# EAGLE design shield3 (EAGLE 7.6.0)
Cypress Robot Kit
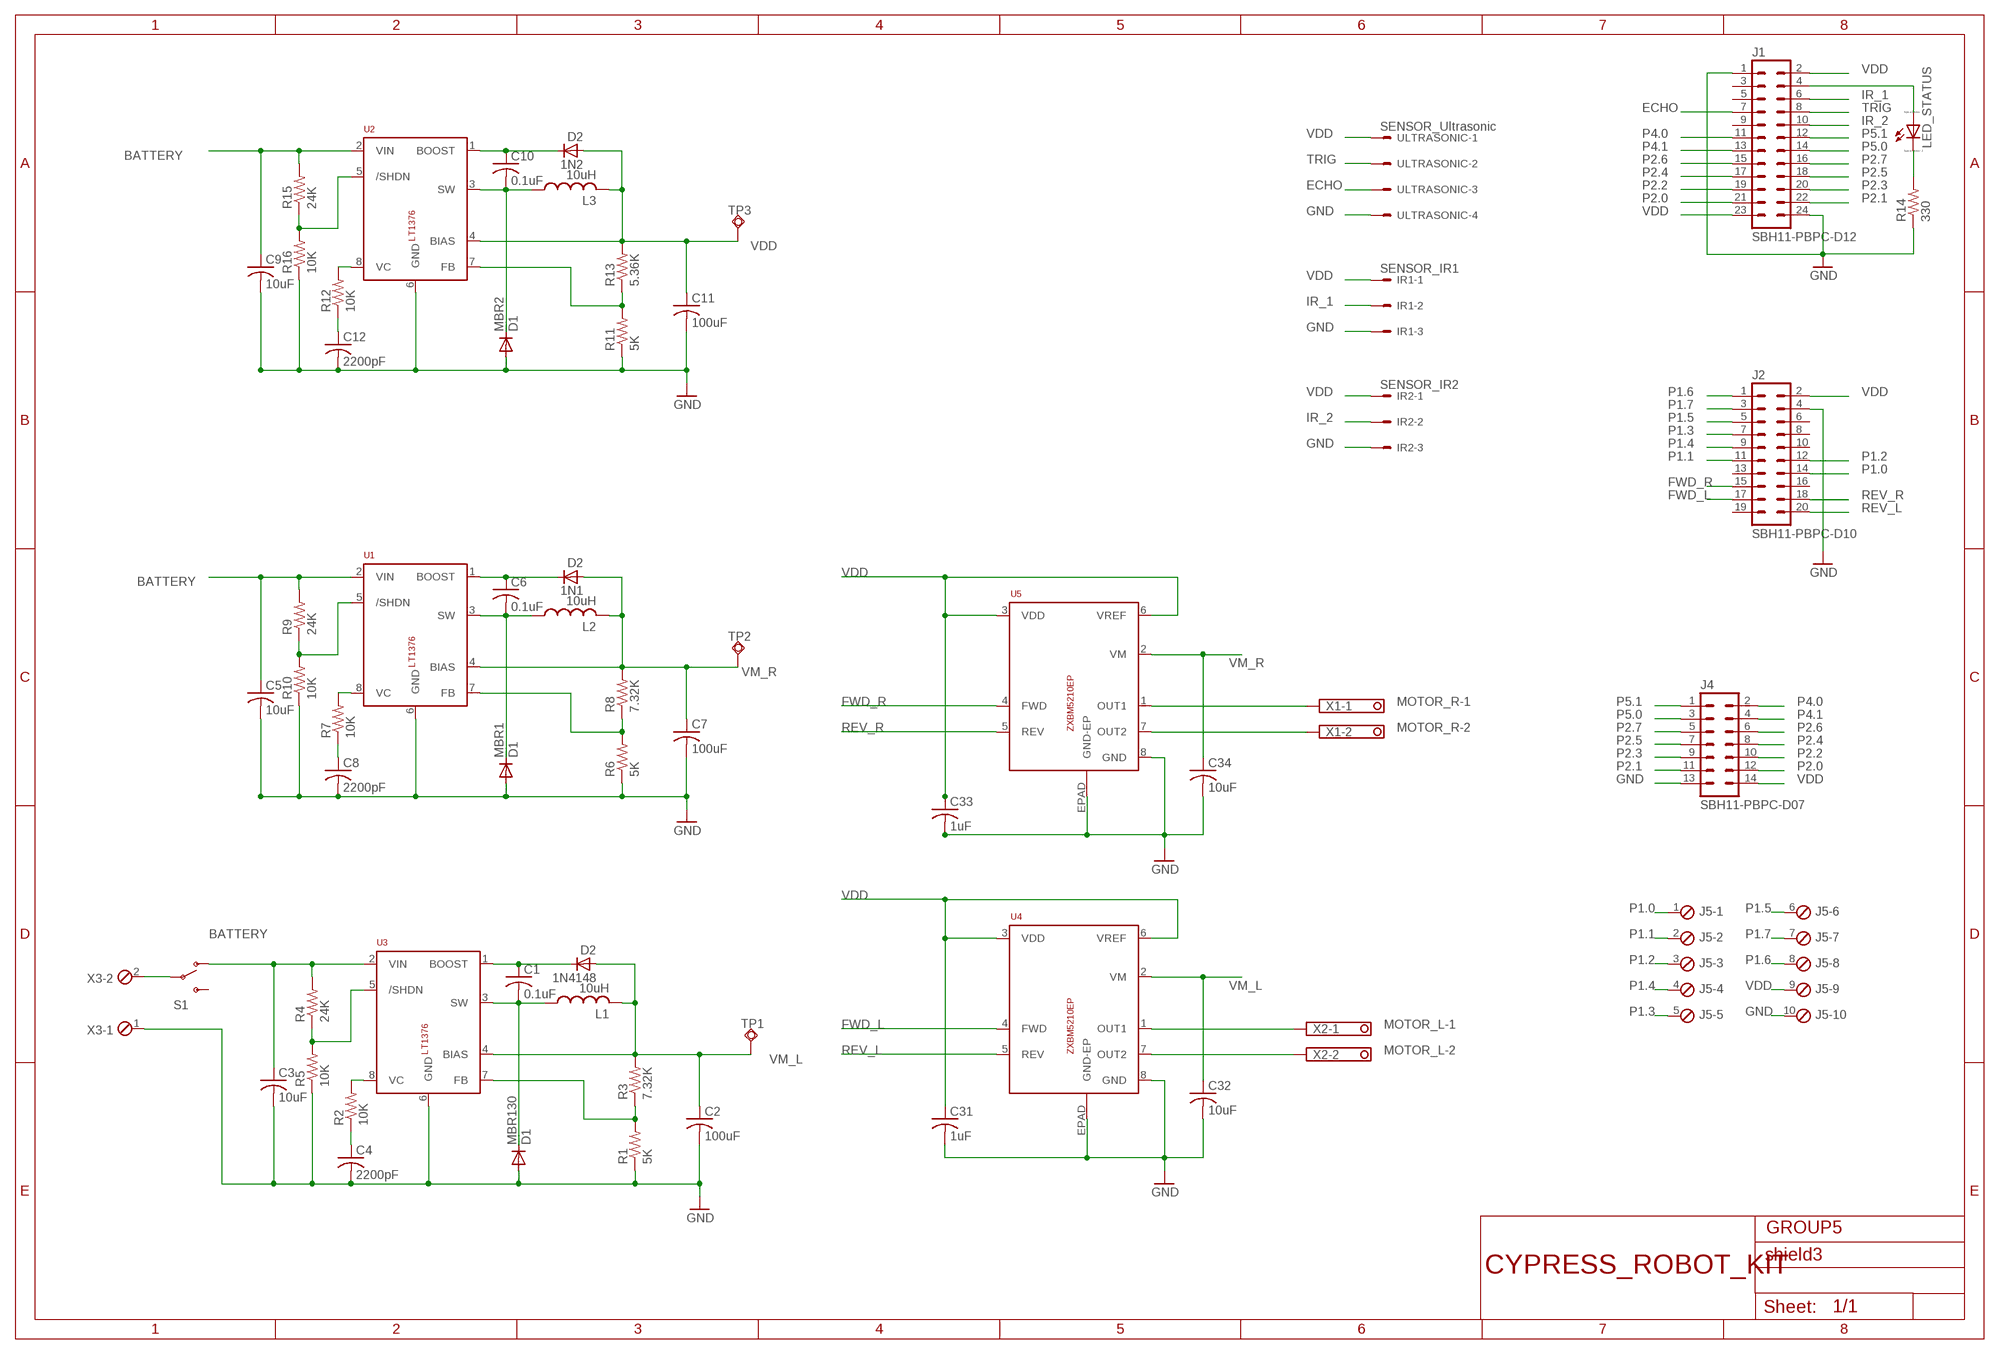
[diagram p0: schematic, sheet 1]

## Parts
1N1  D2  D-SOD123  [SOD123]
1N2  D2  D-SOD123  [SOD123]
1N4148  D2  D-SOD123  [SOD123]
C1  0.1uF  C-USC1206  [C1206]
C2  100uF  C-USC1206  [C1206]
C3  10uF  C-USC1206  [C1206]
C4  2200pF  C-USC1206  [C1206]
C5  10uF  C-USC1206  [C1206]
C6  0.1uF  C-USC1206  [C1206]
C7  100uF  C-USC1206  [C1206]
C8  2200pF  C-USC1206  [C1206]
C9  10uF  C-USC1206  [C1206]
C10  0.1uF  C-USC1206  [C1206]
C11  100uF  C-USC1206  [C1206]
C12  2200pF  C-USC1206  [C1206]
C31  1uF  C-USC3216  [C3216]
C32  10uF  C-USC3216  [C3216]
C33  1uF  C-USC3216  [C3216]
C34  10uF  C-USC3216  [C3216]
IR1  SENSOR_IR1  22-27-2031-03  [6410-03]
IR2  SENSOR_IR2  22-27-2031-03  [6410-03]
J1  SBH11-PBPC-D12  [SBH11-PBPC-D12]
J2  SBH11-PBPC-D10  [SBH11-PBPC-D10]
J4  SBH11-PBPC-D07  [SBH11-PBPC-D07]
J5  MPT10  [10POL254]
L1  10uH  L-USL4035M  [L4035M]
L2  10uH  L-USL4035M  [L4035M]
L3  10uH  L-USL4035M  [L4035M]
LED_STATUS  LED_E  [LED_1206]
MBR1  D1  DIODE-SOD123  [SOD123]
MBR2  D1  DIODE-SOD123  [SOD123]
MBR130  D1  DIODE-SOD123  [SOD123]
R1  5K  R-US_M3216  [M3216]
R2  10K  R-US_M3216  [M3216]
R3  7.32K  R-US_M3216  [M3216]
R4  24K  R-US_M3216  [M3216]
R5  10K  R-US_M3216  [M3216]
R6  5K  R-US_M3216  [M3216]
R7  10K  R-US_M3216  [M3216]
R8  7.32K  R-US_M3216  [M3216]
R9  24K  R-US_M3216  [M3216]
R10  10K  R-US_M3216  [M3216]
R11  5K  R-US_M3216  [M3216]
R12  10K  R-US_M3216  [M3216]
R13  5.36K  R-US_M3216  [M3216]
R14  330  R-US_M3216  [M3216]
R15  24K  R-US_M3216  [M3216]
R16  10K  R-US_M3216  [M3216]
S1  SWITCH-SPDTPTH  [SWITCH-SPDT]
TP1  TPSQPAD1-13  [P1-13]
TP2  TPSQPAD1-13  [P1-13]
TP3  TPSQPAD1-13  [P1-13]
U1  LT1376  [S8]
U2  LT1376  [S8]
U3  LT1376  [S8]
U4  ZXBM5210EP  [SO08-EPAD]
U5  ZXBM5210EP  [SO08-EPAD]
ULTRASONIC  SENSOR_Ultrasonic  22-27-2041-04  [6410-04]
X1  1751248  [1751248]
X2  1751248  [1751248]
X3  MPT2  [2POL254]

## Nets
BATTERY: C3.1 C5.1 C9.1 R4.2 R9.2 R15.2 S1.1(O) U1.2(VIN) U2.2(VIN) U3.2(VIN)
ECHO: J1.7 ULTRASONIC.3
FWD_L: J2.17 U4.4(FWD)
FWD_R: J2.15 U5.4(FWD)
GND: C2.2 C3.2 C4.2 C5.2 C7.2 C8.2 C9.2 C11.2 C12.2 C31.2 C32.2 C33.2 C34.2 IR1.3 IR2.3 J1.1 J1.24 J2.4 J4.13 J5.10 MBR1.A MBR2.A MBR130.A R1.1 R5.1 R6.1 R10.1 R11.1 R14.1 R16.1 U1.6(GND) U2.6(GND) U3.6(GND) U4.8(GND) U4.EPAD(GND-EP) U5.8(GND) U5.EPAD(GND-EP) ULTRASONIC.4 X3.1
IR_1: IR1.2 J1.6
IR_2: IR2.2 J1.10
MOTOR_L-1: U4.1(OUT1) X2.1
MOTOR_L-2: U4.7(OUT2) X2.2
MOTOR_R-1: U5.1(OUT1) X1.1
MOTOR_R-2: U5.7(OUT2) X1.2
N$1: C1.2 L1.1 MBR130.C U3.3(SW)
N$2: R4.1 R5.2 U3.5(/SHDN)
N$4: R1.2 R3.1 U3.7(FB)
N$6: LED_STATUS.C R14.2
N$7: 1N1.1(C) C6.1 U1.1(BOOST)
N$8: J1.4 LED_STATUS.A
N$9: C6.2 L2.1 MBR1.C U1.3(SW)
N$10: R7.2 U1.8(VC)
N$11: C8.1 R7.1
N$12: R6.2 R8.1 U1.7(FB)
N$13: R9.1 R10.2 U1.5(/SHDN)
N$15: 1N2.1(C) C10.1 U2.1(BOOST)
N$16: 1N4148.1(C) C1.1 U3.1(BOOST)
N$17: C10.2 L3.1 MBR2.C U2.3(SW)
N$18: R2.2 U3.8(VC)
N$19: C4.1 R2.1
N$20: R12.2 U2.8(VC)
N$21: C12.1 R12.1
N$22: R11.2 R13.1 U2.7(FB)
N$23: R15.1 R16.2 U2.5(/SHDN)
N$33: S1.2(P) X3.2
P1.0: J2.14 J5.1
P1.1: J2.11 J5.2
P1.2: J2.12 J5.3
P1.3: J2.7 J5.5
P1.4: J2.9 J5.4
P1.5: J2.5 J5.6
P1.6: J2.1 J5.8
P1.7: J2.3 J5.7
P2.0: J1.21 J4.12
P2.1: J1.22 J4.11
P2.2: J1.19 J4.10
P2.3: J1.20 J4.9
P2.4: J1.17 J4.8
P2.5: J1.18 J4.7
P2.6: J1.15 J4.6
P2.7: J1.16 J4.5
P4.0: J1.11 J4.2
P4.1: J1.13 J4.4
P5.0: J1.14 J4.3
P5.1: J1.12 J4.1
REV_L: J2.20 U4.5(REV)
REV_R: J2.18 U5.5(REV)
TRIG: J1.8 ULTRASONIC.2
VDD: 1N2.2(A) C11.1 C31.1 C33.1 IR1.1 IR2.1 J1.2 J1.23 J2.2 J4.14 J5.9 L3.2 R13.2 TP3.TP U2.4(BIAS) U4.3(VDD) U4.6(VREF) U5.3(VDD) U5.6(VREF) ULTRASONIC.1
VM_L: 1N4148.2(A) C2.1 C32.1 L1.2 R3.2 TP1.TP U3.4(BIAS) U4.2(VM)
VM_R: 1N1.2(A) C7.1 C34.1 L2.2 R8.2 TP2.TP U1.4(BIAS) U5.2(VM)
Unconnected: J1.3 J1.5 J1.9 J2.6 J2.8 J2.10 J2.13 J2.16 J2.19 S1.3(S)

## Library data of the parts
1N1 1N2 1N4148 = semicon-smd-ipc:D-: DIODE unfilled
C1-C12 C31-C34 = rcl:C-US: CAPACITOR, American symbol
IR1 IR2 = con-molex:22-?-03: CONNECTOR wire to board 2.54 mm (.1 inch) pitch header; OC_FARNELL: unknown; OC_NEWARK: unknown
J1 = con-sullins:SBH11-PBPC-D12: HEADER - Vertical, Shrouded
J2 = con-sullins:SBH11-PBPC-D10: HEADER - Vertical, Shrouded
J4 = con-sullins:SBH11-PBPC-D07: HEADER - Vertical, Shrouded
J5 = con-phoenix-254:MPT10: PHOENIX CONNECTOR; OC_FARNELL: unknown; OC_NEWARK: unknown
L1-L3 = rcl:L-US: INDUCTOR, American symbol
LED_STATUS = eagle-ltspice:LED_E: LED Source: http://www.osram.convergy.de Source: www.luxeon.com Source: www.kingbright.com; SPICEMODEL: NONE; SPICEPREFIX: D; SPICETYPE: diode
MBR1 MBR2 MBR130 = diode:DIODE-: DIODE
R1-R13 R15 R16 = rcl:R-US_: RESISTOR, American symbol
R14 = resistor:R-US_: RESISTOR, American symbol
S1 = MyLibrary:SWITCH-SPDT: SPDT Switch Simple slide switch, Spark Fun Electronics SKU : COM-00102 DPDT SMT slide switch, AYZ0202, SWCH-08179; PROD_ID: SWCH-08261
TP1-TP3 = testpad:TPSQ: Test pad
U1-U3 = MyLibrary:LT1376
U4 U5 = MyLibrary:ZXBM5210EP
ULTRASONIC = con-molex:22-?-04: CONNECTOR wire to board 2.54 mm (.1 inch) pitch header; OC_FARNELL: unknown; OC_NEWARK: unknown
X1 X2 = con-phoenix-350:1751248: MKDS 1/ 2-3,5 Printklemme Nennstrom: 10 A Bemessungsspannung: 160 V Raster: 3,5 mm Polzahl: 2 Montageart: Löten Anschlussart: Schraubanschluss Anschlussrichtung vom Leiter zur Platine: 0° Source: http://eshop.phoenixcontact.com .. 1751248.pdf; OC_FARNELL: unknown; OC_NEWARK: unknown
X3 = con-phoenix-254:MPT2: PHOENIX CONNECTOR; OC_FARNELL: unknown; OC_NEWARK: unknown

## Board
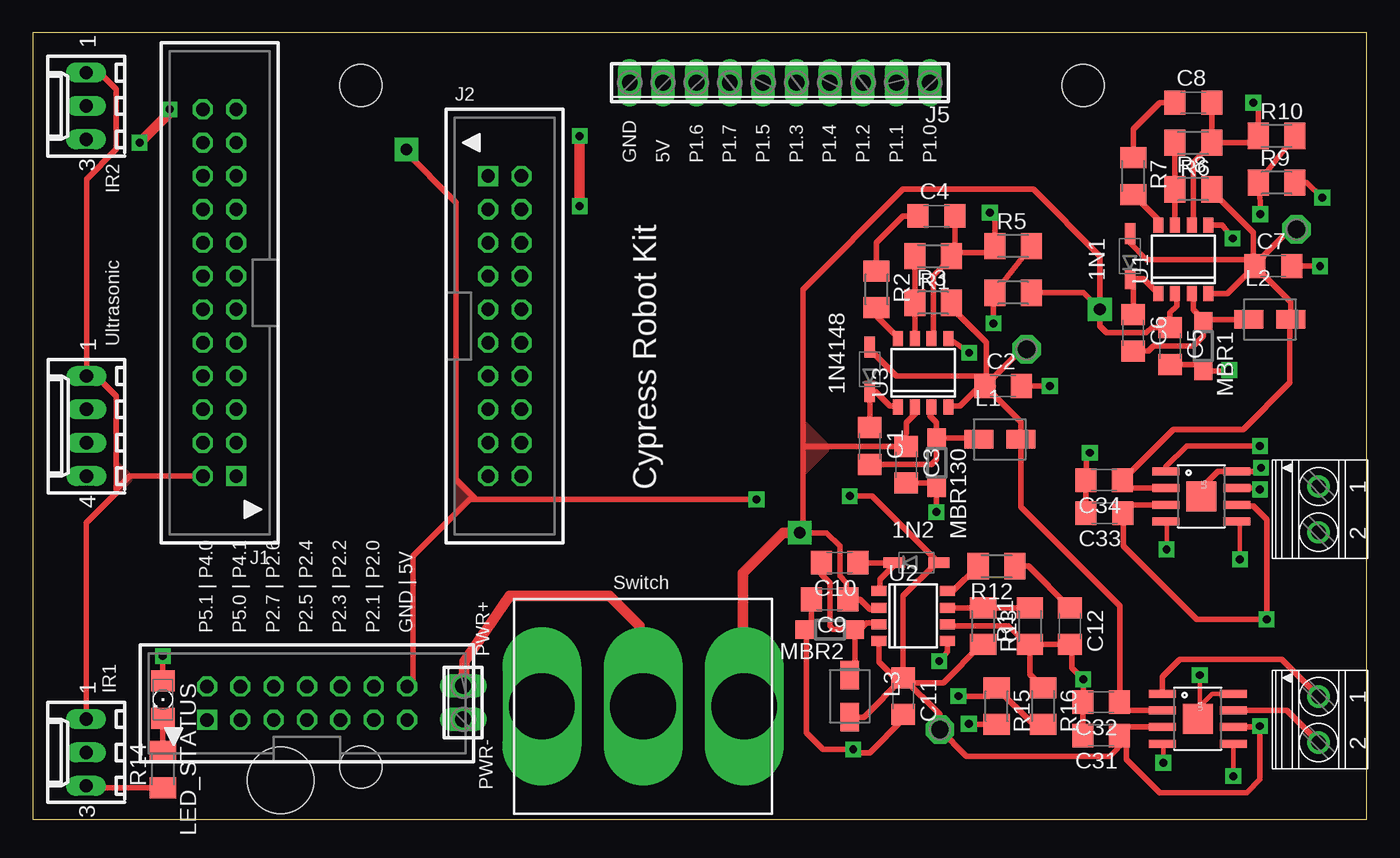
[diagram p1: board, top side]
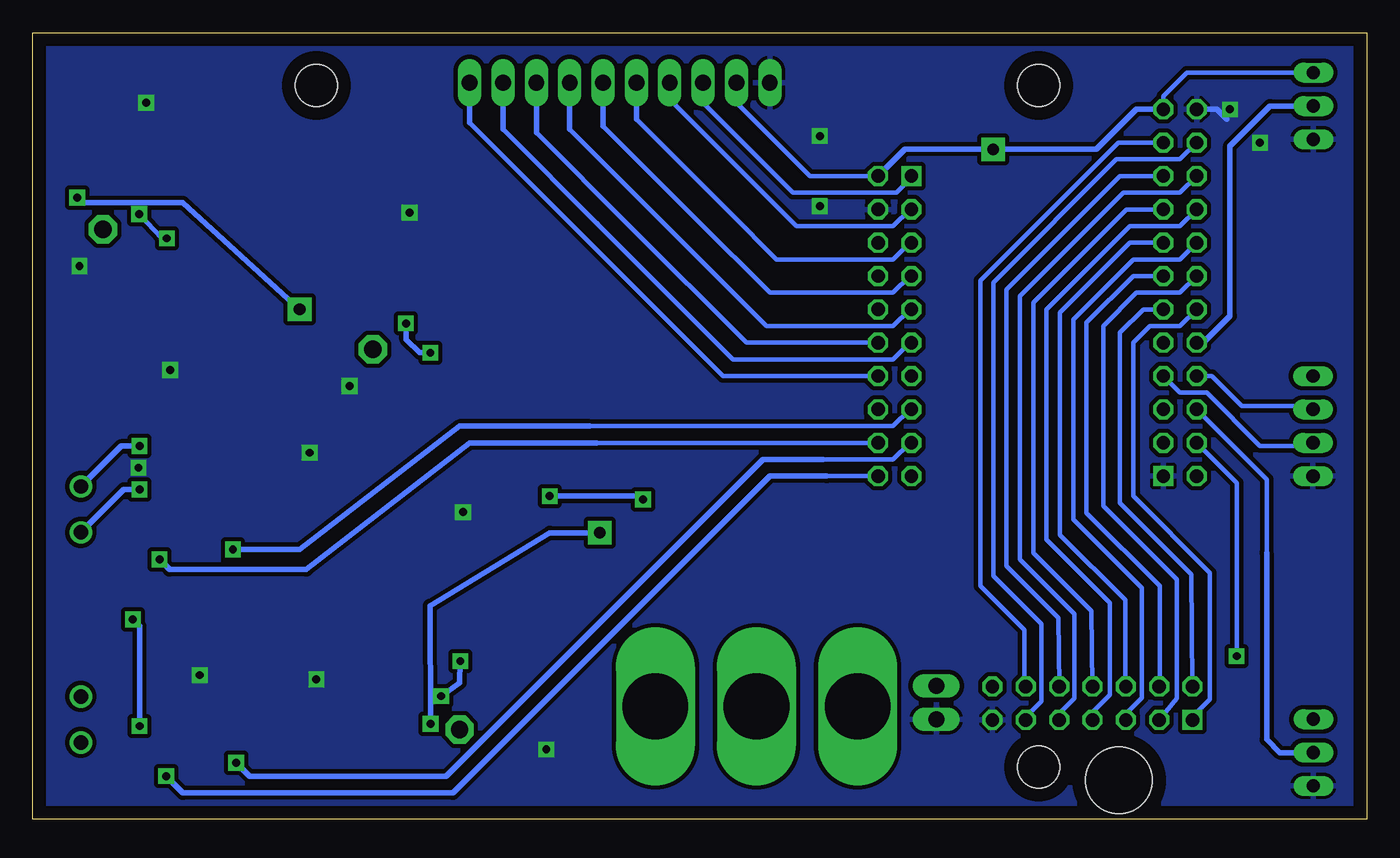
[diagram p2: board, bottom side, seen from below]

Size 101.6 x 59.93 mm. Coordinates in mm from the lower left corner, seen from the top.
Outline: 0,0 101.6,0 101.6,59.93 0,59.93 0,0
Copper layers (1*16): Top 0.035mm / dielectric 1.5mm / Bottom 0.035mm
Design rules "MWSEagleDesignRules2": minimum track width 13mil, minimum drill 22mil, track to track 13mil, track to pad 13mil, pad to pad 13mil, via to via 13mil, smd to smd 8mil, copper to edge 40mil, drill to drill 8mil, minimum pad ring 10mil, minimum via ring 8mil, stop-mask expansion 4mil, vias tented up to drill 0mil, thermal gap 10mil
Holes 3.2 mm at 24.99,3.99 24.99,55.93 79.99,55.93
Holes 5.08 mm at 18.87,2.97

### Footprints (pad centres in the part's own frame; a part is rotated, then mirrored left to right if it is on the bottom)
SOD123 = smd 1.6 x 0.8: 1 -1.7,0; 2 1.7,0
C1206 = smd 1.6 x 1.8: 1 -1.4,0; 2 1.4,0
C3216 = smd 1.6 x 1.8: 1 -1.4,0; 2 1.4,0
6410-03 = drill 1.016 long: 1 2.54,0; 2 0,0; 3 -2.54,0
SBH11-PBPC-D12 = drill 1.016 square: 1 -13.97,-1.27 | drill 1.016 octagon: 2 -13.97,1.27; 3 -11.43,-1.27; 4 -11.43,1.27; 5 -8.89,-1.27; 6 -8.89,1.27; 7 -6.35,-1.27; 8 -6.35,1.27; 9 -3.81,-1.27; 10 -3.81,1.27; 11 -1.27,-1.27; 12 -1.27,1.27; 13 1.27,-1.27; 14 1.27,1.27; 15 3.81,-1.27; 16 3.81,1.27; 17 6.35,-1.27; 18 6.35,1.27; 19 8.89,-1.27; 20 8.89,1.27; 21 11.43,-1.27; 22 11.43,1.27; 23 13.97,-1.27; 24 13.97,1.27
SBH11-PBPC-D10 = drill 1.016 square: 1 -11.43,-1.27 | drill 1.016 octagon: 2 -11.43,1.27; 3 -8.89,-1.27; 4 -8.89,1.27; 5 -6.35,-1.27; 6 -6.35,1.27; 7 -3.81,-1.27; 8 -3.81,1.27; 9 -1.27,-1.27; 10 -1.27,1.27; 11 1.27,-1.27; 12 1.27,1.27; 13 3.81,-1.27; 14 3.81,1.27; 15 6.35,-1.27; 16 6.35,1.27; 17 8.89,-1.27; 18 8.89,1.27; 19 11.43,-1.27; 20 11.43,1.27
SBH11-PBPC-D07 = drill 1.016 square: 1 -7.62,-1.27 | drill 1.016 octagon: 2 -7.62,1.27; 3 -5.08,-1.27; 4 -5.08,1.27; 5 -2.54,-1.27; 6 -2.54,1.27; 7 0,-1.27; 8 0,1.27; 9 2.54,-1.27; 10 2.54,1.27; 11 5.08,-1.27; 12 5.08,1.27; 13 7.62,-1.27; 14 7.62,1.27
10POL254 = drill 1.2 long: 1 -11.43,0; 2 -8.89,0; 3 -6.35,0; 4 -3.81,0; 5 -1.27,0; 6 1.27,0; 7 3.81,0; 8 6.35,0; 9 8.89,0; 10 11.43,0
L4035M = smd 2.2 x 1.4: 1 -1.6,0; 2 1.6,0
LED_1206 = smd 1.6 x 1.803: A -1.422,0; C 1.422,0
SOD123' = smd 1.4 x 1.4: A 1.9,0; C -1.9,0
M3216 = smd 1.6 x 2: 1 -1.4,0; 2 1.4,0
SWITCH-SPDT = drill 5 pad 6 long: 1 0,7.7; 2 0,0; 3 0,-7.7
P1-13 = drill 1.321 pad 2.159 octagon: TP 0,0
S8 = smd 0.762 x 1.143: 1 -1.905,-2.6; 2 -0.635,-2.6; 3 0.635,-2.6; 4 1.905,-2.6; 5 1.905,2.6; 6 0.635,2.6; 7 -0.635,2.6; 8 -1.905,2.6
SO08-EPAD = smd 0.61 x 2.057: 1 -1.905,-2.692; 2 -0.635,-2.692; 3 0.635,-2.692; 4 1.905,-2.692; 5 1.905,2.692; 6 0.635,2.692; 7 -0.635,2.692; 8 -1.905,2.692 | smd 2.286 x 2.286: EPAD 0,0
6410-04 = drill 1.016 long: 1 3.81,0; 2 1.27,0; 3 -1.27,0; 4 -3.81,0
1751248 = drill 1.1 pad 1.7: 1 -1.75,-0.1; 2 1.75,-0.1
2POL254 = drill 1.2 long: 1 -1.27,0; 2 1.27,0

### Placement (x,y rotation side)
1N1  83.57,42.93 90 top
1N2  67.31,19.56 0 top
1N4148  63.75,34.29 90 top
C1  63.75,28.45 270 top
C2  73.91,33.02 0 top
C3  66.52,27.03 270 top
C4  68.83,45.97 0 top
C5  86.61,36.07 270 top
C6  83.82,37.08 270 top
C7  94.49,42.16 0 top
C8  88.39,54.61 0 top
C9  60.71,16.76 180 top
C10  61.47,19.56 180 top
C11  66.29,9.4 270 top
C12  78.99,14.73 270 top
C31  81.37,6.41 180 top
C32  81.37,8.95 180 top
C33  81.63,23.34 180 top
C34  81.6,25.86 180 top
IR1  4.06,5.11 90 top
IR2  4.06,54.36 90 top
J1  14.22,40.13 90 top
J2  35.94,37.59 270 top
J4  20.89,8.86 0 top
J5  56.9,56.13 180 top
L1  73.66,28.96 0 top
L2  94.23,38.1 0 top
L3  62.23,9.4 270 top
LED_STATUS  9.91,9.14 270 top
MBR1  D1  [SOD123']  89.15,36.07 270 top
MBR2  D1  [SOD123']  60.71,14.48 180 top
MBR130  D1  [SOD123']  68.83,27.18 270 top
R1  68.58,42.93 180 top
R2  64.26,40.39 270 top
R3  68.58,39.37 0 top
R4  74.68,40.13 0 top
R5  74.68,43.69 0 top
R6  88.39,51.56 180 top
R7  83.82,49.02 270 top
R8  88.39,48.01 0 top
R9  94.74,48.51 0 top
R10  94.74,52.07 0 top
R11  75.95,14.73 90 top
R12  73.41,19.3 180 top
R13  72.39,14.73 270 top
R14  9.91,3.81 90 top
R15  73.41,8.64 270 top
R16  76.96,8.64 270 top
S1  46.48,8.62 270 top
TP1  75.69,35.81 90 top
TP2  96.27,44.96 90 top
TP3  69.09,6.86 0 top
U1  87.63,42.67 0 top
U2  67.06,15.49 270 top
U3  67.82,34.04 0 top
U4  88.73,7.68 270 top
U5  89.01,24.61 270 top
ULTRASONIC  4.09,29.97 90 top
X1  98.04,23.62 270 top
X2  98.04,7.62 270 top
X3  32.78,8.9 90 top

### Tracks (layer width: path | path; a pad name or v marks a point on that pad's centre or on a via)
BATTERY  (via drill 0.6, 0.9)
  Top 0.406: U1.2 87.12,39.95 87.12,39.12 86.61,38.61 C5.1 85.22,37.47 84.84,37.08 81.79,37.08 81.28,37.59 v81.28,38.86 | U3.2 67.31,31.31 67.31,30.99 66.55,30.23 C3.1 58.7,28.43 58.67,28.45 | U2.2 64.33,16 63.75,16 62.99,16.76 C9.1 61.98,16.89 61.98,18.03 61.47,18.54 61.47,20.83 60.45,21.84 v58.42,21.84 58.67,22.1 58.67,28.45 | R9.2 97.03,48.51 v98.22,47.37 | R15.2 71.35,7.24 v71.3,7.29 | R4.2 80.01,40.13 v81.28,38.86 | v81.28,38.86 81.28,42.93 76.2,48.01 66.29,48.01 58.67,40.39 58.67,28.45
  Top 0.813: v58.42,21.84 57.15,21.84 54.1,18.8 54.1,8.7 S1.1
  Bottom 0.406: v81.28,38.86 90.17,46.99 98.04,46.99 v98.22,47.37 | v71.3,7.29 71.35,16.28 62.23,21.84 v58.42,21.84
  pour Top: 58.67,30.23 60.45,28.45 60.45,28.19 58.67,26.42 58.67,29.97
ECHO
  Bottom 0.356: ULTRASONIC.3 4.34,28.45 8.13,28.45 12.19,32.51 14.22,32.51 J1.7
FWD_L  (via drill 0.6)
  Top 0.356: v86.11,4.32 86.11,5.71 U4.4
  Bottom 0.356: J2.17 34.8,28.7 36.07,27.43 41.4,27.43 | 85.34,3.56 v86.11,4.32
  Bottom 0.406: 41.4,27.43 45.97,27.43 70.1,3.3 85.09,3.3 v86.11,4.32
FWD_R  (via drill 0.6)
  Top 0.356: v86.36,20.57 86.36,22.67 U5.4
  Bottom 0.356: J2.15 34.8,31.24 36.07,29.97 59.18,29.97
  Bottom 0.406: 59.18,29.97 69.09,29.97 81.28,20.57 v86.36,20.57
GND  (via drill 0.6)
  Top 0.356: v88.9,11 88.9,8.64 | 88.9,8.64 88.9,7.84 U4.EPAD | U4.8 89.84,9.58 88.9,8.64
  Top 0.406: R14.1 4.22,2.41 IR1.3 | C31.2 C32.2 80.01,8.99 v80.01,10.67 79.14,11.54 79.14,13.33 C12.2 R11.1 | C33.2 80.2,23.36 C34.2 80.26,25.92 80.26,27.69 v80.52,27.94 | v93.56,26.8 93.35,26.52 U5.8 90.27,26.52 89.15,25.4 89.15,24.76 U5.EPAD | R6.1 C8.2 | C5.2 88.65,34.67 MBR1.A 90.81,34.17 v91.14,34.24 | C4.2 70.23,43.18 | 70.23,43.18 R1.1 69.98,42.85 68.58,41.45 68.58,36.76 U3.6 | C3.2 68.49,25.63 MBR130.A v68.83,23.42 | 70.23,43.18 72.77,43.18 R5.1 73.28,45.85 v72.9,46.23 | R6.1 92.83,51.56 R10.1 93.34,54.23 v92.96,54.61 | R6.1 89.79,51.46 88.39,50.06 88.39,45.4 U1.6 | R11.1 75.75,13.33 74.32,14.76 69.76,14.76 U2.6 | C9.2 59.31,14.98 MBR2.A 58.93,14.36 58.93,6.6 60.2,5.33 v62.48,5.33 62.74,5.08 63.75,5.08 66.29,7.62 C11.2 | R11.1 75.95,11.05 R16.1 | C7.2 v98.04,42.16 | C2.2 v77.47,33.02 | v10.41,54.1 10.41,53.85
  Top 0.813: v41.66,52.07 v41.66,46.74 | 10.41,53.85 v8.13,51.56
  Bottom 0.406: J1.24 11.43,54.1 10.67,53.34 10.67,53.85 v10.41,54.1
  pour Bottom: 0,59.69 101.6,59.69 101.6,0 0,0
IR_1
  Bottom 0.356: J1.6 7.62,25.91 7.62,20.32
  Bottom 0.406: 7.62,20.32 7.62,6.1 6.6,5.08 4.09,5.08 IR1.2
IR_2
  Bottom 0.406: J1.10 12.45,36.32 10.41,38.35 10.41,51.31 7.37,54.36 IR2.2 3.56,54.36
MOTOR_L-1
  Top 0.406: U4.1 86.04,10.86 87.38,12.19 95.12,12.19 X2.1
MOTOR_L-2
  Top 0.406: U4.7 95.5,8.31 X2.2
MOTOR_R-1  (via drill 0.6)
  Top 0.406: U5.1 86.32,26.88 87.88,28.45 v93.47,28.45
  Bottom 0.406: v93.47,28.45 94.87,28.45 X1.1
MOTOR_R-2  (via drill 0.6)
  Top 0.406: U5.7 93.37,25.25 v93.47,25.15
  Bottom 0.406: v93.47,25.15 94.67,25.15 X1.2
N$1
  Top 0.406: MBR130.C 68.83,30.23 68.33,30.73 68.33,31.31 U3.3 | C1.2 68.45,27.05 68.83,27.43 MBR130.C | MBR130.C 71.94,29.08 L1.1
N$2  (via drill 0.6)
  Top 0.406: U3.5 69.79,36.64 v71.32,35.56 | v73.18,37.8 73.15,40.01 R4.1 R5.2
  Bottom 0.406: v71.32,35.56 72.14,35.56 73.15,36.58 v73.18,37.8
N$4
  Top 0.406: U3.7 67.18,39.12 R3.1 R1.2
N$6
  Top 0.406: LED_STATUS.C R14.2
N$7
  Top 0.406: C6.1 83.82,40.97 1N1.1 84.57,41.23 U1.1
N$8  (via drill 0.6)
  Top 0.406: v9.91,12.45 LED_STATUS.A
  Bottom 0.356: v9.91,12.45 9.91,25.65 J1.4
N$9
  Top 0.406: 89.15,38.1 MBR1.C 89.15,36.83 88.39,36.07 85.34,36.07 84.96,35.68 C6.2 | 89.15,38.1 88.39,38.86 88.39,39.95 U1.3 | 89.15,38.1 L2.1
N$10
  Top 0.406: U1.8 85.72,45.72 R7.2
N$11
  Top 0.406: R7.1 83.82,52.58 85.85,54.61 C8.1
N$12
  Top 0.406: U1.7 R8.1 R6.2
N$13  (via drill 0.6)
  Top 0.406: U1.5 90.62,45.27 v91.39,44.27 | v93.5,46.13 93.47,48.38 R9.1 R10.2
  Bottom 0.356: v91.39,44.27 91.75,44.27 v93.5,46.13
N$15
  Top 0.406: C10.1 1N2.1 65.61,19.38 64.52,18.29 64.52,17.46 U2.1
N$16
  Top 0.406: C1.1 1N4148.1 64.18,32.59 65.28,31.5 65.85,31.5 U3.1
N$17
  Top 0.406: MBR2.C 62.99,14.48 63.5,14.99 64.33,14.99 U2.3 | C10.2 60.07,18.67 60.71,18.03 60.71,14.73 60.96,14.48 MBR2.C | MBR2.C 62.61,11.37 L3.1
N$18
  Top 0.406: U3.8 65.91,36.7 64.26,38.35 R2.2
N$19
  Top 0.406: R2.1 64.26,43.94 66.29,45.97 C4.1
N$20
  Top 0.406: U2.8 70.1,17.4 R12.2
N$21
  Top 0.406: R12.1 75.82,19.3 C12.1
N$22
  Top 0.406: U2.7 R13.1 R11.2
N$23  (via drill 0.6)
  Top 0.406: R16.2 76.21,7.24 R15.1 72.77,9.4 v70.51,9.4 | U2.5 69.66,12.76 v69.04,12.06
  Bottom 0.406: v69.04,12.06 69.09,10.41 v70.51,9.4
N$33
  Top 0.813: X3.2 32.88,12.05 36.32,17.02 43.94,17.02 46.23,14.73 46.23,8.87 S1.2
P1.0
  Bottom 0.356: J2.14 49.02,33.78 61.21,45.97 68.33,53.09
  Bottom 0.406: J5.1 68.33,53.09
P1.1
  Bottom 0.356: J2.11 34.8,36.32 36.07,35.05 48.26,35.05 58.42,45.21 | 58.42,45.21 58.67,45.47 | 65.79,52.58 58.42,45.21
  Bottom 0.406: J5.2 65.79,52.58
P1.2
  Bottom 0.356: J2.12 47.24,36.32 56.13,45.21 63.25,52.32
  Bottom 0.406: J5.3 63.25,52.32
P1.3
  Bottom 0.356: J2.7 34.8,41.4 36.07,40.13 45.47,40.13 51.05,45.72 58.17,52.83
  Bottom 0.406: J5.5 58.17,52.83
P1.4
  Bottom 0.356: J2.9 34.8,38.86 36.07,37.59 45.72,37.59 53.59,45.47 60.71,52.58
  Bottom 0.406: J5.4 60.71,52.58
P1.5
  Bottom 0.356: J2.5 34.8,43.94 36.07,42.67 44.96,42.67 48.51,46.23 55.63,53.34
  Bottom 0.406: J5.6 55.63,53.34
P1.6
  Bottom 0.356: 50.55,54.61 43.69,47.75 35.81,47.75 34.67,48.9 J2.1
  Bottom 0.406: J5.8 50.55,54.61
P1.7
  Bottom 0.356: J2.3 34.8,46.48 36.07,45.21 43.43,45.21 45.72,47.5 | 45.72,47.5 45.97,47.75 | 53.09,54.86 45.72,47.5
  Bottom 0.406: J5.7 53.09,54.86
P2.0
  Bottom 0.356: J1.21 18.9,51.56 29.41,41.05 29.41,17.78 26.09,14.45 26.09,10.4 J4.12
P2.1
  Bottom 0.356: J1.22 14.22,50.29 19.05,50.29 28.45,40.89 28.45,18.54 24.79,14.88 24.79,8.99 25.97,7.81 J4.11
P2.2
  Bottom 0.356: J4.10 23.5,15.37 27.43,19.3 27.43,40.39 18.8,49.02 J1.19
P2.3
  Bottom 0.356: J1.20 14.22,47.75 18.54,47.75 26.42,39.88 26.42,19.81 22.28,15.67 22.28,9.25 23.5,8.02 J4.9
P2.4
  Bottom 0.356: J1.17 18.29,46.48 25.4,39.37 25.4,20.32 20.96,15.88 J4.8
P2.5
  Bottom 0.356: J4.7 20.96,8.1 19.56,9.5 19.56,16.51 24.38,21.34 24.38,38.86 18.03,45.21 14.22,45.21 J1.18
P2.6
  Bottom 0.356: J1.15 18.03,43.94 23.37,38.61 23.37,21.69 18.39,16.71 18.39,10.39 J4.6
P2.7
  Bottom 0.356: J1.16 14.22,42.67 17.78,42.67 22.35,38.1 22.35,22.86 17.12,17.63 17.12,9.27 18.42,7.97 J4.5
P4.0
  Bottom 0.356: J1.11 17.02,38.86 18.8,37.08 18.8,24.13 13.34,18.68 J4.2
P4.1
  Bottom 0.356: J1.13 17.78,41.4 21.34,37.85 21.34,23.37 15.75,17.78 15.75,10.49 J4.4
P5.0
  Bottom 0.356: J1.14 14.22,40.13 17.53,40.13 20.07,37.59 20.07,23.88 14.48,18.29 14.48,9.22 J4.3
P5.1
  Bottom 0.356: J1.12 14.22,37.59 16.51,37.59 17.78,36.32 17.78,24.64 11.94,18.8 11.94,9.14 13.27,7.81 J4.1
REV_L  (via drill 0.6)
  Top 0.356: v91.44,3.3 91.44,5.75 U4.5
  Bottom 0.356: J2.20 41.15,26.16
  Bottom 0.406: 41.15,26.16 45.47,26.16 69.6,2.03 90.17,2.03 v91.44,3.3
REV_R  (via drill 0.6)
  Top 0.356: v91.95,19.81 91.95,22.46 U5.5
  Bottom 0.356: J2.18 58.67,28.7
  Bottom 0.406: 58.67,28.7 68.33,28.7 80.77,19.05 91.19,19.05 v91.95,19.81
TRIG
  Bottom 0.356: ULTRASONIC.2 4.34,31.5 9.53,31.5 11.81,33.78 J1.8
VDD  (via drill 0.6, 0.9)
  Top 0.356: IR2.1 5.08,56.9
  Top 0.406: IR1.1 4.06,22.61 6.35,24.89 6.35,25.15 | 5.08,56.9 6.35,55.63 6.35,51.05 4.09,48.79 ULTRASONIC.1 4.83,33.78 6.35,32.26 6.35,25.15 | U4.3 83.4,7.04 C31.1 | L3.2 63.29,7.8 C11.1 | U2.4 64.46,12 65.79,10.67 66.16,10.67 C11.1 | C11.1 66.29,17.02 68.83,19.56 1N2.2 63.93,24.64 v62.23,24.64 | R13.2 72.26,13.33 69.34,10.41 66.68,10.41 C11.1 | C11.1 69.09,8 TP3.TP 71.12,4.83 82.04,4.83 83.19,5.98 | C31.1 82.77,5.8 | 83.06,23.31 C33.1 82.8,23.56 82.8,23.88 82.91,23.98 U5.3 83.16,23.98 83.06,23.88 83.06,20.83 88.65,15.24 v93.98,15.24 93.98,22.86 92.96,23.88 91.81,23.88 U5.6 | J1.2 7.37,26.16 6.35,25.15 | v55.12,24.38 33.78,24.38 | 33.78,24.38 32.26,25.91 32.26,46.99 28.19,51.05 v28.45,51.05 | v93.47,7.11 93.4,7.04 U4.6 93.29,7.04 93.47,6.86 93.47,3.05 92.46,2.03 85.85,2.03 83.31,4.57 83.31,5.86 83.19,5.98 | 83.19,5.98 C31.1 | 33.78,24.38 33.27,24.38 28.96,20.07 28.96,10.58 J4.14
  Bottom 0.356: J1.23 15.49,55.12 13.72,56.9 IR2.1 | J5.9 48.01,54.61 42.42,49.02 J2.2
  Bottom 0.406: J1.23 17.53,54.1 20.57,51.05 v28.45,51.05 35.18,51.05 J2.2 | v62.23,24.64 55.37,24.64 v55.12,24.38 | v93.47,7.11 93.47,14.73 v93.98,15.24
  pour Top: 6.35,27.18 7.37,26.16 7.37,25.91 6.35,24.89 6.35,26.92
  pour Top: 32.26,25.65 32.26,23.37 33.53,24.64 32.26,25.91
VM_L
  Top 0.406: U4.2 83.4,8.31 C32.1 82.8,8.98 82.8,16.26 75.26,23.8 L1.2 75.26,30.27 C2.1 | C2.1 72.14,33.02 70.61,31.5 69.78,31.5 U3.4 | 1N4148.2 63.75,35.81 65.79,33.78 72.39,33.78 73.15,33.02 C2.1 | R3.2 69.98,38.99 72.64,36.32 72.64,33.15 C2.1 | TP1.TP 75.31,35.81 C2.1
VM_R
  Top 0.406: C34.1 83.61,25.25 U5.2 83.72,25.25 83.06,25.91 86.87,29.72 92.2,29.72 95.76,33.27 95.76,38.02 L2.2 95.83,39.42 C7.1 | U1.4 91,40.07 C7.1 | 1N1.2 83.57,43.94 84.84,42.67 92.58,42.67 C7.1 | R8.2 89.79,47.88 92.96,44.7 92.96,42.29 C7.1 | C7.1 93.73,42.8 93.73,42.93 95.76,44.96 TP2.TP 96.51,44.96

### Text on the board
tPlace: GND / 5V / P1.6 / P1.7 / P1.5 / P1.3 / P1.4 / P1.2 / P1.1 / P1.0 | IR2 | Ultrasonic | Switch | P5.1 | P4.0 / P5.0 | P4.1 / P2.7 | P2.6 / P2.5 | P2.4 / P2.3 | P2.2 / P2.1 | P2.0 / GND | 5V | PWR+ | IR1 | PWR-
tSilk: Cypress Robot Kit